# Altium schematic sheet NMOS_motor_SW.SchDoc
size A4
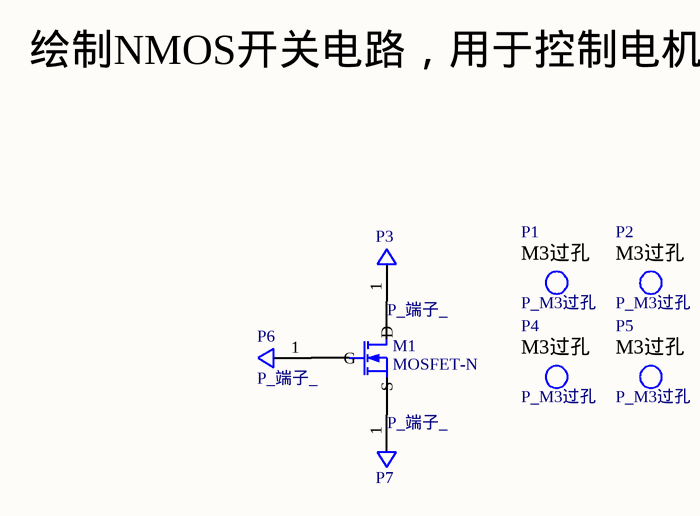
[diagram p0: NMOS_motor_SW.SchDoc]

## Parts
M1  MOSFET-N  [MOSFET_N-CHANNEL_IRLR8726PBF]
P1  P_M3过孔  [P_M3过孔]
P2  P_M3过孔  [P_M3过孔]
P3  P_端子_  [P_排母_2*1]
P4  P_M3过孔  [P_M3过孔]
P5  P_M3过孔  [P_M3过孔]
P6  P_端子_  [P_排母_2*1]
P7  P_端子_  [P_排母_2*1]

## Nets
NetM1_1: M1.1(G) P6.1(pin1)
NetM1_2: M1.2(D) P3.1(pin1)
NetM1_3: M1.3(S) P7.1(pin1)

## Notes on the sheet
- 绘制NMOS开关电路，用于控制电机电流通断
- (in symbol P_M3过孔) M3过孔

## Library data of the parts
M1 = MOSFET-N: N-Channel MOSFET; Published: 8-Jun-2000; LatestRevisionDate: 17-Jul-2002; LatestRevisionNote: Re-released for DXP Platform.; PackageVersion: 1995/1996; PackageReference: E3; Publisher: Altium Limited; PackageDescription: TO, Flat Index; 3 In-Line, Axial Leads; Body Dia. 4.6mm; Lead Dia. 0.5 mm (max)